# EAGLE design versao1b (EAGLE 7.4.0)
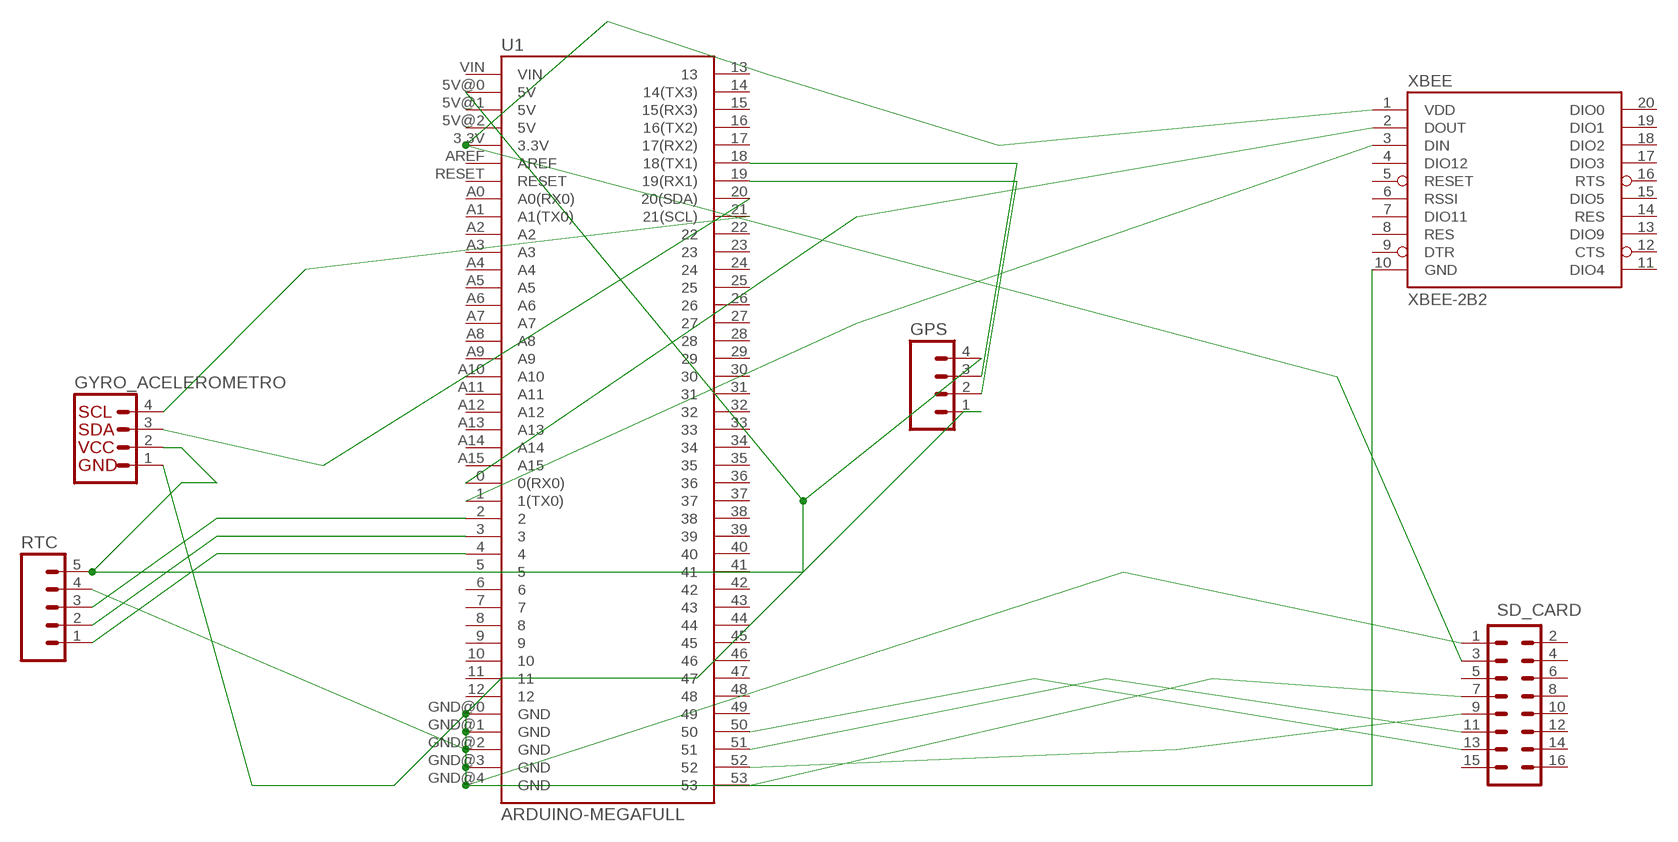
[diagram p0: schematic, sheet 1]

## Parts
GPS  M04LOCK  [1X04_LOCK]
GYRO_ACELEROMETRO  I2C_STANDARD  [1X04]
RTC  M05LOCK  [1X05_LOCK]
SD_CARD  M08X2  [2X8]
U1  ARDUINO-MEGAFULL  [ARDUINO_MEGA]
XBEE  XBEE-2B2  [XBEE-SILK]

## Nets
GND: GPS.1 GYRO_ACELEROMETRO.1 RTC.4 SD_CARD.1 U1.GND@0(GND) U1.GND@1(GND) U1.GND@2(GND) U1.GND@3(GND) U1.GND@4(GND) XBEE.10(GND)
N$1: GPS.4 GYRO_ACELEROMETRO.2 RTC.5 U1.5V@0(5V)
N$2: RTC.3 U1.2
N$3: U1.0(0(RX0)) XBEE.2(DOUT)
N$4: U1.1(1(TX0)) XBEE.3(DIN)
N$6: SD_CARD.3 U1.3.3V XBEE.1(VDD)
N$9: GPS.3 U1.18(18(TX1))
N$10: GPS.2 U1.19(19(RX1))
N$11: RTC.2 U1.3
N$12: RTC.1 U1.4
N$14: GYRO_ACELEROMETRO.3 U1.20(20(SDA))
N$15: GYRO_ACELEROMETRO.4 U1.21(21(SCL))
N$16: SD_CARD.13 U1.50
N$17: SD_CARD.11 U1.51
N$18: SD_CARD.9 U1.52
N$19: SD_CARD.7 U1.53
Unconnected: SD_CARD.2 SD_CARD.4 SD_CARD.5 SD_CARD.6 SD_CARD.8 SD_CARD.10 SD_CARD.12 SD_CARD.14 SD_CARD.15 SD_CARD.16 U1.5 U1.5V@1(5V) U1.5V@2(5V) U1.6 U1.7 U1.8 U1.9 U1.10 U1.11 U1.12 U1.13 U1.14(14(TX3)) U1.15(15(RX3)) U1.16(16(TX2)) U1.17(17(RX2)) U1.22 U1.23 U1.24 U1.25 U1.26 U1.27 U1.28 U1.29 U1.30 U1.31 U1.32 U1.33 U1.34 U1.35 U1.36 U1.37 U1.38 U1.39 U1.40 U1.41 U1.42 U1.43 U1.44 U1.45 U1.46 U1.47 U1.48 U1.49 U1.A0(A0(RX0)) U1.A1(A1(TX0)) U1.A2 U1.A3 U1.A4 U1.A5 U1.A6 U1.A7 U1.A8 U1.A9 U1.A10 U1.A11 U1.A12 U1.A13 U1.A14 U1.A15 U1.AREF U1.RESET U1.VIN XBEE.4(DIO12) XBEE.5(RESET) XBEE.6(RSSI) XBEE.7(DIO11) XBEE.8(RES) XBEE.9(DTR) XBEE.11(DIO4) XBEE.12(CTS) XBEE.13(DIO9) XBEE.14(RES) XBEE.15(DIO5) XBEE.16(RTS) XBEE.17(DIO3) XBEE.18(DIO2) XBEE.19(DIO1) XBEE.20(DIO0)

## Library data of the parts
GPS = SparkFun-Connectors:M04: Header 4 Standard 4-pin 0.1" header. Use with straight break away headers (SKU : PRT-00116), right angle break away headers (PRT-00553), swiss pins (PRT-00743), machine pins (PRT-00117), and female headers (PRT-00115). Molex polarized connector foot print use with SKU : PRT-08231 with associated crimp pins and housings. 1MM SMD Version SKU: PRT-10208
GYRO_ACELEROMETRO = SparkFun-Connectors:I2C_STANDARD: SparkFun has standardized on a pinout for all I2C based sensor breakouts. This pinout allows I2C boards to be plugged directly into the headers on Arduino Uno compatible boards, and to be daisy chained easily.
RTC = SparkFun-Connectors:M05: Header 5 Standard 5-pin 0.1" header. Use with straight break away headers (SKU : PRT-00116), right angle break away headers (PRT-00553), swiss pins (PRT-00743), machine pins (PRT-00117), and female headers (PRT-00115). Molex polarized connector foot print use with SKU : PRT-08230 with associated crimp pins and housings.
SD_CARD = SparkFun-Connectors:M08X2: .1" headers, two rows of 8 each
U1 = SparkFun-Boards:ARDUINO-MEGA: Arduino Mega board footprint
XBEE = SparkFun-RF:XBEE-2: Xbee module footprints SMT header is CONN-09042.

## Net classes
0 default: width 0.001 mm

## Board
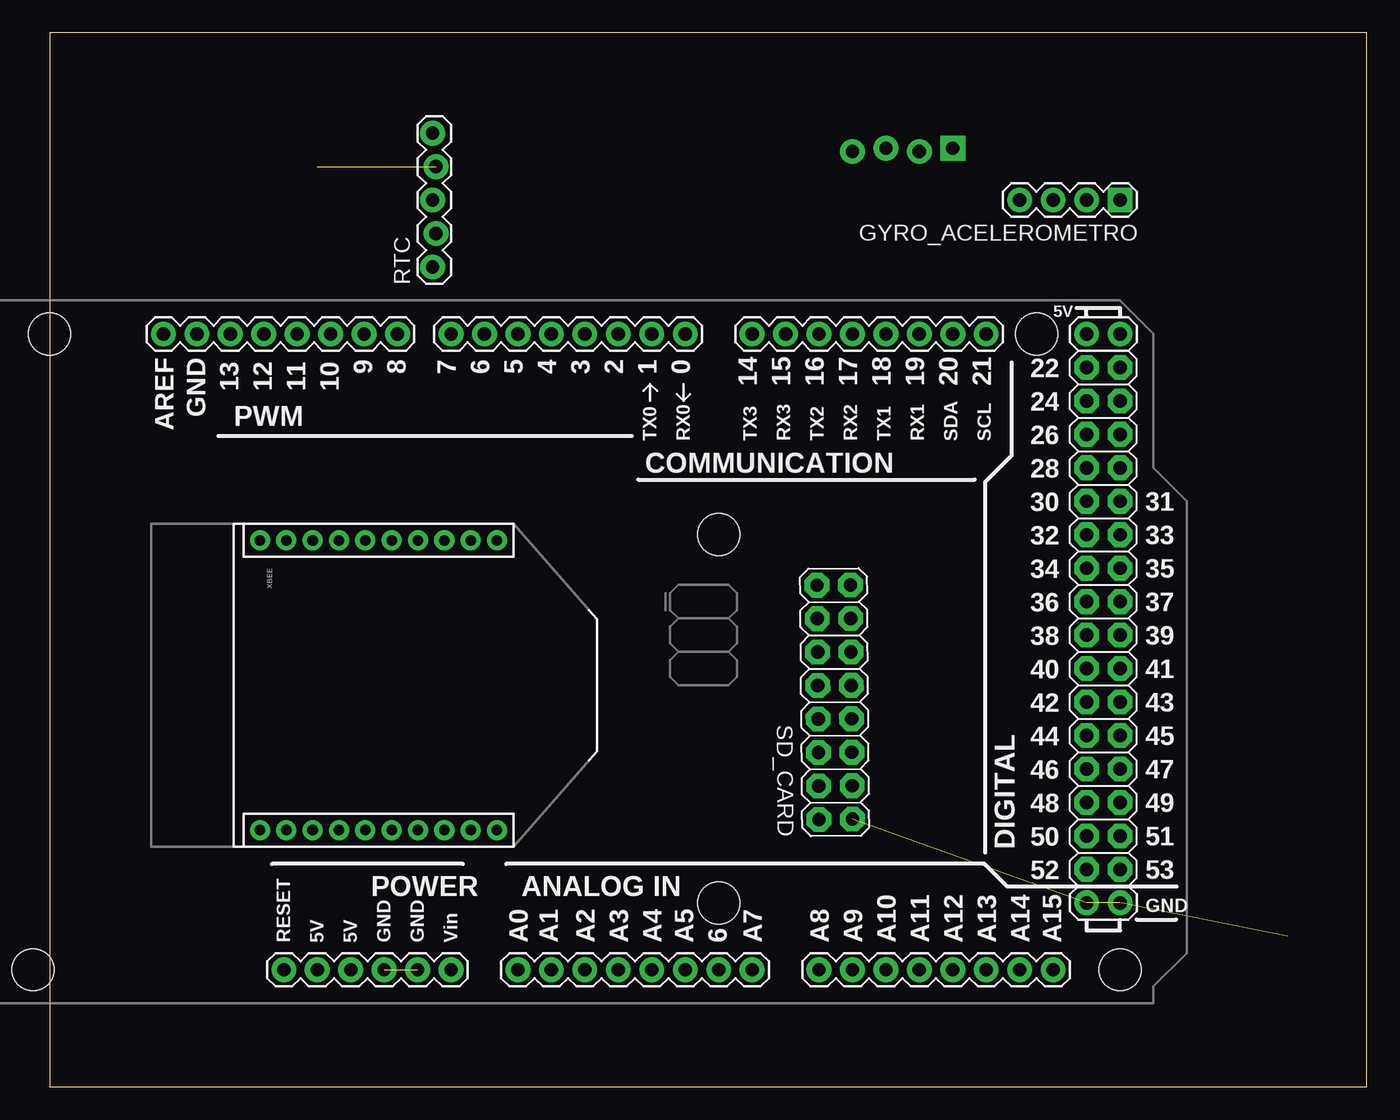
[diagram p1: board, top side]
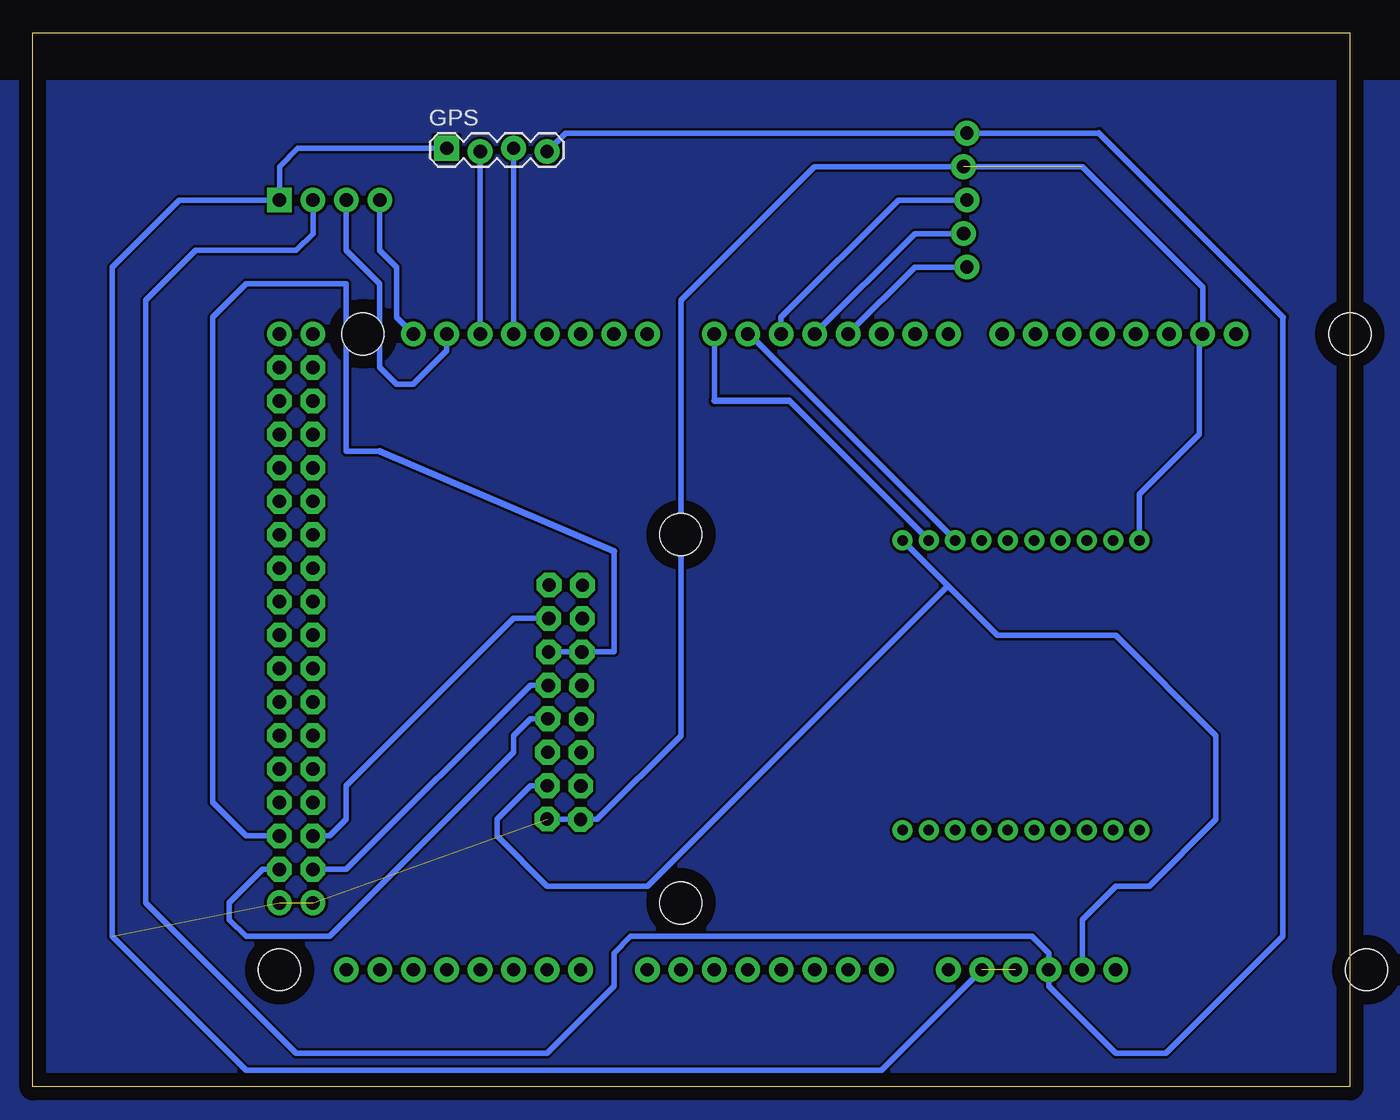
[diagram p2: board, bottom side, seen from below]

Size 100 x 80 mm. Coordinates in mm from the lower left corner, seen from the top.
Outline: 0,0 100,0 100,80 0,80 0,0
Copper layers (1*16): Top 0.035mm / dielectric 1.5mm / Bottom 0.035mm
Design rules "default *": minimum track width 0.2mm, minimum drill 0.7mm, track to track 8mil, track to pad 8mil, pad to pad 8mil, via to via 8mil, smd to smd 8mil, copper to edge 40mil, drill to drill 8mil, minimum pad ring 10mil, minimum via ring 8mil, stop-mask expansion 4mil, vias tented up to drill 0mil, thermal gap 10mil

### Footprints (pad centres in the part's own frame; a part is rotated, then mirrored left to right if it is on the bottom)
1X04_LOCK = drill 1.016 pad 1.88 square: 1 0,0.127 | drill 1.016 pad 1.88: 2 2.54,-0.127; 3 5.08,0.127; 4 7.62,-0.127
1X04 = drill 1.016 pad 1.88 square: 1 0,0 | drill 1.016 pad 1.88: 2 2.54,0; 3 5.08,0; 4 7.62,0
1X05_LOCK = drill 1.016 pad 1.88: 1 0,0.127; 2 2.54,-0.127; 3 5.08,0.127; 4 7.62,-0.127; 5 10.16,0.127
2X8 = drill 1.016 pad 1.88 octagon: 1 0,0; 2 0,2.54; 3 2.54,0; 4 2.54,2.54; 5 5.08,0; 6 5.08,2.54; 7 7.62,0; 8 7.62,2.54; 9 10.16,0; 10 10.16,2.54; 11 12.7,0; 12 12.7,2.54; 13 15.24,0; 14 15.24,2.54; 15 17.78,0; 16 17.78,2.54
ARDUINO_MEGA = drill 1.016 pad 1.88: 0 63.5,50.8; 1 60.96,50.8; 2 58.42,50.8; 3 55.88,50.8; 3.3V 35.56,2.54; 4 53.34,50.8; 5 50.8,50.8; 5V@0 38.1,2.54; 5V@1 93.98,50.8; 5V@2 96.52,50.8; 6 48.26,50.8; 7 45.72,50.8; 8 41.656,50.8; 9 39.116,50.8; 10 36.576,50.8; 11 34.036,50.8; 12 31.496,50.8; 13 28.956,50.8; 14 68.58,50.8; 15 71.12,50.8; 16 73.66,50.8; 17 76.2,50.8; 18 78.74,50.8; 19 81.28,50.8; 20 83.82,50.8; 21 86.36,50.8; A0 50.8,2.54; A1 53.34,2.54; A2 55.88,2.54; A3 58.42,2.54; A4 60.96,2.54; A5 63.5,2.54; A6 66.04,2.54; A7 68.58,2.54; A8 73.66,2.54; A9 76.2,2.54; A10 78.74,2.54; A11 81.28,2.54; A12 83.82,2.54; A13 86.36,2.54; A14 88.9,2.54; A15 91.44,2.54; AREF 23.876,50.8; GND@0 40.64,2.54; GND@1 43.18,2.54; GND@2 93.98,7.62; GND@3 96.52,7.62; GND@4 26.416,50.8; RESET 33.02,2.54; VIN 45.72,2.54 | drill 1.016 pad 1.88 octagon: 22 93.98,48.26; 23 96.52,48.26; 24 93.98,45.72; 25 96.52,45.72; 26 93.98,43.18; 27 96.52,43.18; 28 93.98,40.64; 29 96.52,40.64; 30 93.98,38.1; 31 96.52,38.1; 32 93.98,35.56; 33 96.52,35.56; 34 93.98,33.02; 35 96.52,33.02; 36 93.98,30.48; 37 96.52,30.48; 38 93.98,27.94; 39 96.52,27.94; 40 93.98,25.4; 41 96.52,25.4; 42 93.98,22.86; 43 96.52,22.86; 44 93.98,20.32; 45 96.52,20.32; 46 93.98,17.78; 47 96.52,17.78; 48 93.98,15.24; 49 96.52,15.24; 50 93.98,12.7; 51 96.52,12.7; 52 93.98,10.16; 53 96.52,10.16 | hole 3.2: 15.24,50.8; 13.97,2.54; 66.04,35.56; 66.04,7.62; 90.17,50.8; 96.52,2.54
XBEE-SILK = drill 0.8 pad 1.524: 1 -11,20; 2 -11,18; 3 -11,16; 4 -11,14; 5 -11,12; 6 -11,10; 7 -11,8; 8 -11,6; 9 -11,4; 10 -11,2; 11 11,2; 12 11,4; 13 11,6; 14 11,8; 15 11,10; 16 11,12; 17 11,14; 18 11,16; 19 11,18; 20 11,20

### Placement (x,y rotation side)
GPS  68.58,71.12 0 bottom
GYRO_ACELEROMETRO  81.28,67.31 180 top
RTC  29.21,62.23 90 top
SD_CARD  60.96,20.32 90.5 top
U1  -15.24,6.35 0 top
XBEE  13.97,30.48 270 top

### Tracks (layer width: path | path; a pad name or v marks a point on that pad's centre or on a via)
GND  (5 unrouted)
  Bottom 0.406: SD_CARD.1 57.15,20.32 50.8,26.67 50.8,59.69 40.64,69.85 20.32,69.85 11.18,60.71 U1.GND@4 11.43,56.9 11.43,49.53 15.97,44.99 XBEE.10 | U1.GND@1 35.56,1.27 83.82,1.27 93.98,11.43 93.98,62.23 88.9,67.31 GYRO_ACELEROMETRO.1 81.28,69.85 79.88,71.25 GPS.1
N$1
  Bottom 0.406: GPS.4 59.56,72.39 RTC.5 19.05,72.39 | 5.08,58.42 5.08,11.43 13.97,2.54 17.78,2.54 22.86,7.62 U1.5V@0 22.86,10.16 24.13,11.43 54.61,11.43 55.88,10.16 55.88,7.62 60.96,2.54 80.01,2.54 91.44,13.97 91.44,59.69 87.63,63.5 80.01,63.5 78.74,64.77 GYRO_ACELEROMETRO.2
  Bottom 0.508: 19.05,72.39 5.08,58.42
N$2
  Bottom 0.406: RTC.3 34.29,67.31 43.18,58.42 U1.2
N$3
  Bottom 0.406: 48.26,52.07 U1.0
  Bottom 0.508: XBEE.2 42.56,52.07 48.26,52.07
N$4
  Bottom 0.406: 45.64,57.15 U1.1
  Bottom 0.508: XBEE.3 45.64,57.15
N$5
  pour Bottom: -2.54,76.2 104.14,76.2 104.14,-2.54 -5.08,-2.54 -5.08,74.93 arc-90 -3.81,76.2
N$6
  Bottom 0.406: U1.3.3V 20.32,12.7 17.78,15.24 15.24,15.24 10.16,20.32 10.16,26.67 17.78,34.29 26.78,34.29 30.54,38.05 | 30.54,38.05 XBEE.1 | SD_CARD.3 62.23,22.86 64.77,20.32 64.77,19.05 60.96,15.24 53.34,15.24 30.54,38.05
N$9
  Bottom 0.406: GPS.3 U1.18
N$10
  Bottom 0.406: GPS.2 U1.19
N$11
  Bottom 0.406: U1.3 33.02,64.77 RTC.2
N$12
  Bottom 0.406: U1.4 33.02,62.23 RTC.1
N$14
  Bottom 0.406: GYRO_ACELEROMETRO.3 76.2,63.5 73.66,60.96 73.66,54.61 72.39,53.34 71.12,53.34 68.58,55.88 U1.20
N$15
  Bottom 0.406: GYRO_ACELEROMETRO.4 73.66,63.5 72.39,62.23 72.39,58.42 U1.21
N$16
  Bottom 0.406: SD_CARD.13 63.5,35.56 76.2,22.86 76.2,20.32 77.47,19.05 U1.50
N$17
  Bottom 0.406: SD_CARD.11 | SD_CARD.11 55.88,33.02 55.88,40.64 | 73.66,48.26 76.2,48.26 76.2,60.96 83.82,60.96 86.36,58.42 86.36,21.59 83.82,19.05 U1.51
  Bottom 0.508: 55.88,40.64 73.66,48.26
N$18
  Bottom 0.406: U1.52 76.2,16.51 62.23,30.48 SD_CARD.9
N$19
  Bottom 0.406: U1.53 82.55,16.51 85.09,13.97 85.09,12.7 83.82,11.43 77.47,11.43 63.5,25.4 63.5,26.67 62.23,27.94 SD_CARD.7 | SD_CARD.7